# EasyEDA Pro project ProPrj_GSPro Keyboard_2026-01-17.epro, board PCB4
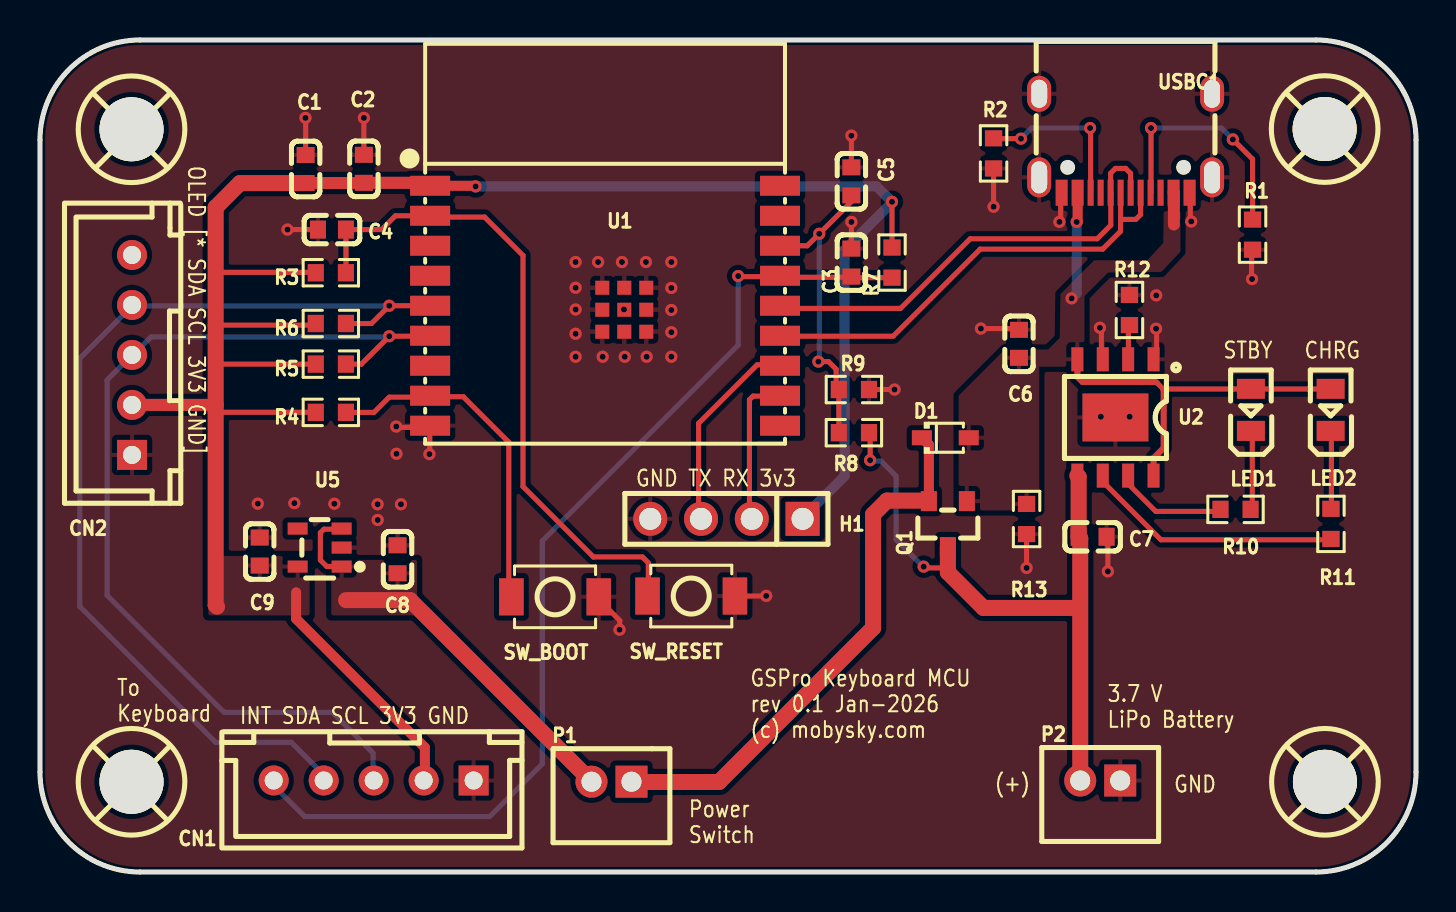
[diagram p5: board, top side]
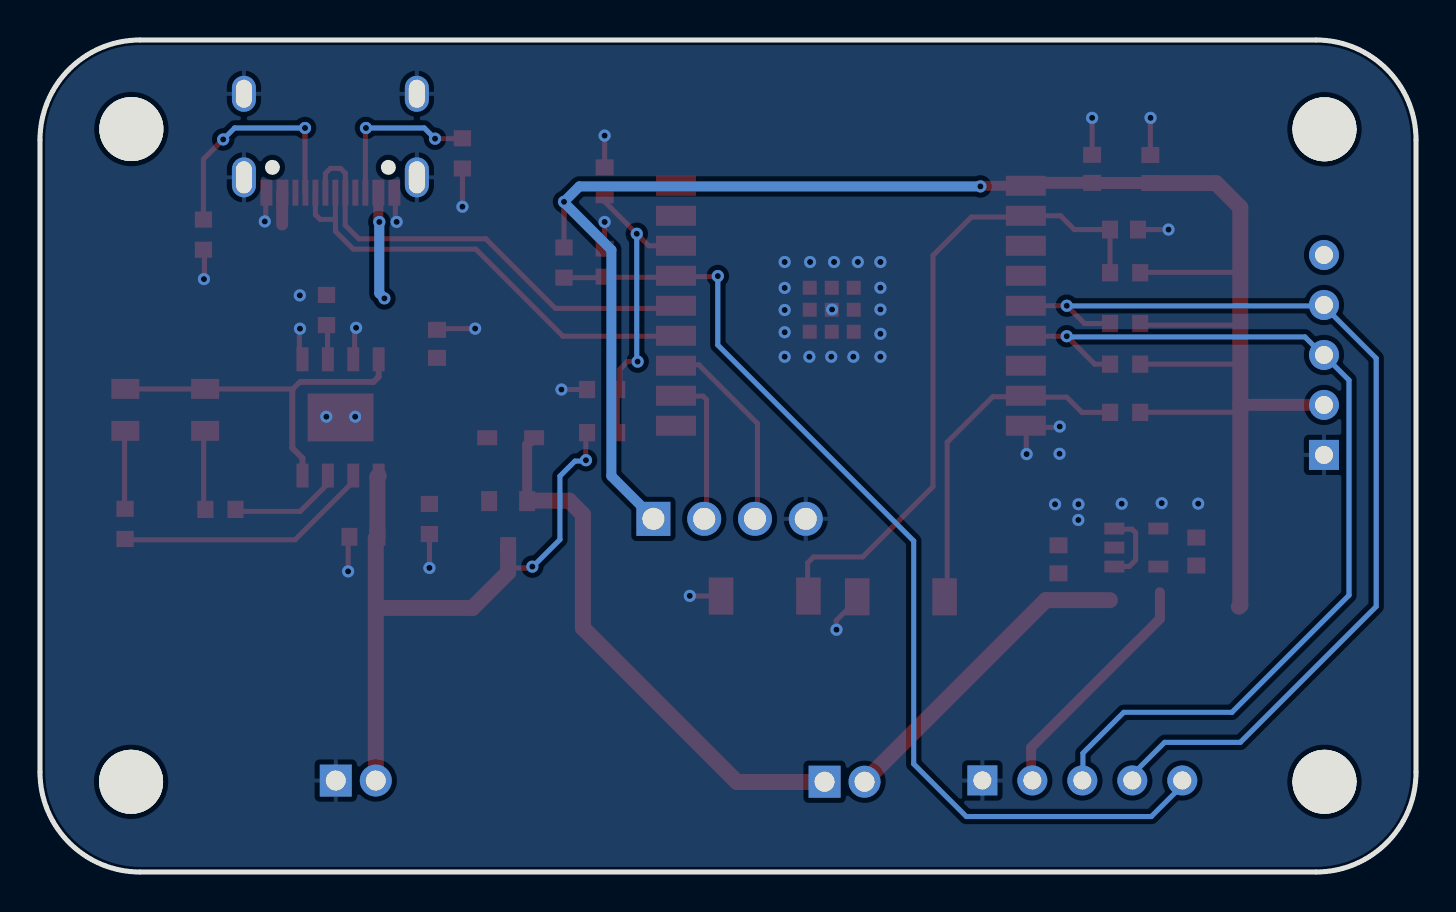
[diagram p6: board, bottom side, seen from below]

Outline 68.82 x 41.62 mm; copper layers: Top Layer, Bottom Layer. Coordinates in mm from the lower left corner of the outline.
Outline path: 0,36.62 0,5 arc(1.46,1.46) 5,0 63.82,0 arc(67.36,1.46) 68.82,5 68.82,36.62 arc(67.36,40.15) 63.82,41.62 5,41.62 arc(1.46,40.15) 0,36.62
Stack: Top Layer 0.035mm / Dielectric1 1.51mm FR4 er 4.5 / Bottom Layer 0.035mm

## Design rules (mm)
template: JLCPCB Capability(Two Layers Board)
spacing copperThickness1oz (default): track to track 0.102, other pairs 0.152 to 0.3
spacing copperThickness2oz: track to track 0.203, other pairs 0.152 to 0.3
track width copperThickness1oz (default): min 0.127, default 0.254, max 2.54
track width copperThickness2oz: min 0.203, default 0.254, max 2.54
differential pair differentialPair (default): width min 0.127, default 0.254, max 2.54; gap min 0.152, default 0.152
via viaSize (default): diameter min 0.5, default 0.61, max 10; hole min 0.3, default 0.305, max 6.3

## Placement (name value [footprint] x y rotation side)
C1  10uF  [C0603]  13.29 35.17 270 top
C2  100nF  [C0603]  16.2 35.17 270 top
C3  100nF  [C0603]  40.58 30.48 270 top
C4  1uF  [C0603]  14.6 32.14 0 top
C5  100nF  [C0603]  40.58 34.55 270 top
C6  10uF  [C0603]  48.97 26.42 270 top
C7  10uF  [C0603]  52.65 16.77 180 top
C8  10uF  [C0603]  17.88 15.64 270 top
C9  10uF  [C0603]  10.99 16.03 270 top
CN1  I2C_KEYBOARD  [CONN-TH_5P-P2.50_WAFER-XH254Z-5A]  16.69 4.58 180 top
CN2  I2C_OLED  [CONN-TH_5P-P2.50_WAFER-XH254Z-5A]  4.6 25.86 90 top
D1  1N5819WS  [SOD-323_L1.8-W1.3-LS2.5-RD]  45.28 21.72 0 top
H1  PZ254V-11-04P  [HDR-TH_4P-P2.54-V-M]  34.33 17.67 180 top
LED1  LED_R_CHRG  [LED0805-R-RD]  60.57 23.12 90 top
LED2  LED_G_FULL  [LED0805-R-RD]  64.55 23.12 90 top
P1  PWR_SWITCH  [CONN-TH_2P-P2.00_PH-2A_C2319]  28.58 4.52 0 top
P2  BAT  [CONN-TH_2P-P2.00_PH-2A_C2319]  53.03 4.58 0 top
Q1  AO3401A  [SOT-23_L2.9-W1.3-P1.90-LS2.4-BR]  45.41 17.4 90 top
R1  5.1kΩ  [R0603]  60.65 31.88 90 top
R2  5.1kΩ  [R0603]  47.69 35.95 90 top
R3  10kΩ  [R0603]  14.55 29.98 180 top
R4  10kΩ  [R0603]  14.55 22.99 180 top
R5  4.7kΩ  [R0603]  14.55 25.4 180 top
R6  4.7kΩ  [R0603]  14.55 27.44 180 top
R7  10kΩ  [R0603]  42.62 30.48 90 top
R8  100kΩ  [R0603]  40.71 21.98 0 top
R9  100kΩ  [R0603]  40.71 24.13 180 top
R10  1kΩ  [R0603]  59.8 18.14 0 top
R11  1kΩ  [R0603]  64.57 17.41 270 top
R12  2kΩ  [R0603]  54.49 28.11 90 top
R13  100kΩ  [R0603]  49.35 17.66 90 top
SCREW1  -  [Screw-Hole-M3]  4.64 37.09 0 top
SCREW2  -  [Screw-Hole-M3]  64.32 37.1 0 top
SCREW3  -  [Screw-Hole-M3]  64.33 4.45 0 top
SCREW4  -  [Screw-Hole-M3]  4.64 4.45 0 top
SW_BOOT  TS-1088-AR02016  [SW-SMD_L3.9-W3.0-P4.45]  25.76 13.77 0 top
SW_RESET  TS-1088-AR02016  [SW-SMD_L3.9-W3.0-P4.45]  32.57 13.8 0 top
U1  2.4GHz  [BULETM-SMD_ESPRESSIF_ESP32-C3-WROOM-02-N4-4MB]  28.26 28.33 0 top
U2  TP4056  [ESOP-8_L4.9-W3.9-P1.27-LS6.0-BL-EP]  53.79 22.74 180 top
U5  AP2112K-3.3TRG1  [SOT-23-5_L2.9-W1.6-P0.95-LS2.8-BR]  13.99 16.23 0 top
USBC1  TYPE-C-31-M-12  [USB-C_SMD-TYPE-C-31-M-12_1]  54.3 36.45 180 top

## Footprints (pads in the part's own frame, mm; a bottom-side part is the same pattern mirrored in y, then rotated)
BULETM-SMD_ESPRESSIF_ESP32-C3-WROOM-02-N4-4MB
  rect 2x1 smd: 1(-8.75,6) 2(-8.75,4.5) 3(-8.75,3) 4(-8.75,1.5) 5(-8.75,0) 6(-8.75,-1.5) 7(-8.75,-3) 8(-8.75,-4.5) 9(-8.75,-6) 10(8.75,-6) 11(8.75,-4.5) 12(8.75,-3) 13(8.75,-1.5) 14(8.75,0) 15(8.75,1.5) 16(8.75,3) 17(8.75,4.5) 18(8.75,6)
  rect 0.7x0.7 smd: 19(-0.14,0.9) 19(-0.14,-0.2) 19(-0.14,-1.3) 19(0.96,0.9) 19(0.96,-0.2) 19(0.96,-1.3) 19(2.06,0.9) 19(2.06,-0.2) 19(2.06,-1.3)
C0603
  rect 0.8x0.9 smd: 1(-0.7,0) 2(0.7,0)
CONN-TH_2P-P2.00_PH-2A_C2319
  rect 1.6x1.6 hole 1: 1(1,0)
  round 1.6 hole 1: 2(-1,0)
CONN-TH_5P-P2.50_WAFER-XH254Z-5A
  rect 1.5x1.5 hole 0.9: 1(-5,0)
  round 1.5 hole 0.9: 2(-2.5,0) 3(0,0) 4(2.5,0) 5(5,0)
ESOP-8_L4.9-W3.9-P1.27-LS6.0-BL-EP
  rect 0.6x1.2 smd: 1(-1.905,-2.909) 2(-0.635,-2.909) 3(0.635,-2.909) 4(1.905,-2.909) 5(1.905,2.909) 6(0.635,2.909) 7(-0.635,2.909) 8(-1.905,2.909)
  rect 3.3x2.4 smd: 9(0,0)
HDR-TH_4P-P2.54-V-M
  rect 1.7x1.7 hole 1.1: 1(-3.81,0)
  round 1.7 hole 1.1: 2(-1.27,0) 3(1.27,0) 4(3.81,0)
LED0805-R-RD
  rect 1x1.399 smd: 1(1.05,0) 2(-1.05,0)
R0603
  rect 0.806x0.864 smd: 1(-0.753,0) 2(0.753,0)
Screw-Hole-M3
  round 3.2 hole 3.2: 1(-0.064,0.064)
SOD-323_L1.8-W1.3-LS2.5-RD
  rect 1x0.75 smd: 1(-1.173,0) 2(1.173,0)
SOT-23-5_L2.9-W1.6-P0.95-LS2.8-BR
  rect 1x0.6 smd: 1(1.1,-0.95) 2(1.1,0) 3(1.1,0.95) 4(-1.1,0.95) 5(-1.1,-0.95)
SOT-23_L2.9-W1.3-P1.90-LS2.4-BR
  rect 1x0.8 smd: 1(1.15,-0.95) 2(1.15,0.95) 3(-1.15,0)
SW-SMD_L3.9-W3.0-P4.45
  rect 1.23x1.86 smd: 1(-2.185,0) 2(2.185,0)
USB-C_SMD-TYPE-C-31-M-12_1
  oval 1.2x2 hole 0.8x1.6: 1(4.325,1.706) 4(-4.325,1.706)
  oval 1.2x1.8 hole 0.8x1.4: 2(4.325,-2.474) 3(-4.325,-2.474)
  custom 0.6x1.3 smd: A1B12(-3.2,2.474) A4B9(-2.4,2.474) B1A12(3.2,2.474) B4A9(2.401,2.474)
  rect 0.3x1.3 smd: A5(-1.25,2.474) A6(-0.25,2.474) A7(0.25,2.474) A8(1.25,2.474) B5(1.75,2.474) B6(0.75,2.474) B7(-0.75,2.474) B8(-1.75,2.474)

## Nets
As in the schematic.

Pads without a net: CN2 5; SCREW1 1; SCREW2 1; SCREW3 1; SCREW4 1; U1 3 4 7 10 17 18; U5 4; USBC1 A8 B8

## Via types
v1: diameter 0.61, hole 0.305, Top Layer to Bottom Layer, 61 vias

## Routing (per net, layer and track width the routed paths; a pad name or vN(x,y) marks a point on that pad's centre or on a via; arc(x,y) is an arc through that point)
3V3: length 110.6
  Top Layer w0.254: R7.2 v1(42.62,33.52) ; 13.7,30 8.95,30 8.92,29.97 ; 8.79,23.01 8.8,23 13.79,23 ; 13.79,27.41 13.73,27.35 8.79,27.35 ; 13.74,25.4 8.81,25.4 ; 13.79,23 R4.2
  Top Layer w0.5: v1(21.79,34.29) 21.76,34.33 U1.1 ; 19.25,4.66 19.25,6.22 12.81,12.66 12.81,13.99
  Top Layer w0.6: U1.1 19.37,34.47 C2.2 16.19,34.47 C1.2 ; 4.47,23.37 8.79,23.37
  Top Layer w0.8: 8.86,13.27 8.79,13.34 8.79,33.24 10.01,34.46 13.15,34.46
  Bottom Layer w0.5: v1(42.62,33.52) 41.84,34.29 v1(21.79,34.29) ; 38.13,17.69 40.25,19.81 40.25,31.12 42.62,33.5
GND: length 27.9
  Top Layer w0.254: 53.09,25.94 53.09,26.98 52.97,27.1 ; 19.5,22.25 19.5,21 19.57,20.92 ; v1(49.35,15.21) R13.1 ; 30.33,29.21 30.36,29.18 ; v1(16.2,37.72) C2.1 ; R9.1 v1(42.74,24.13) ; 55.85,26.98 55.85,25.91 55.84,25.9 ; v1(47.69,33.28) R2.1 ; 53.37,16.67 53.41,16.63 v1(53.41,15.04) ; v1(47.06,27.18) 48.9,27.18 C6.1 ; 57.53,33.62 57.53,32.59 v1(57.58,32.54) ; 19.07,22.32 18.99,22.24 17.81,22.24 ; v1(50.99,32.52) 51.05,32.58 51.05,33.57 ; 29,12.21 29,12.58 28.32,13.26 ; 60.6,29.68 60.6,30.89 60.65,30.95 ; v1(40.58,32.52) C3.1 ; 34.84,13.95 34.99,13.8 36.31,13.8 v1(36.32,13.81) ; C1.1 13.29,37.71 v1(13.28,37.72) ; v1(12.38,32.14) C4.1 ; C5.1 v1(40.58,36.83)
  vias: v1(10.89,18.42) v1(12.72,18.45) v1(14.72,18.42) v1(16.89,18.4) v1(16.89,17.61) v1(17.82,22.28) v1(17.83,20.92) v1(18.05,18.4) v1(19.48,20.9) v1(26.79,30.51) v1(26.79,29.23) v1(26.79,28.14) v1(26.79,26.92) v1(26.79,25.77) v1(27.92,30.51) v1(28.14,25.77) v1(28.99,12.12) v1(29.11,30.51) v1(29.21,28.14) v1(29.25,25.77) v1(30.31,30.51) v1(30.34,25.77) v1(31.58,30.51) v1(31.58,29.22) v1(31.58,28.11) v1(31.58,27) v1(31.58,25.77) v1(53.01,27.22) v1(53.06,22.77) v1(54.5,22.77) v1(55.83,28.84) v1(55.82,27.18) v1(60.62,29.66)
VBAT: length 32.8
  Top Layer w0.254: 44.3,15.21 45.41,15.21 ; 41.51,21.88 41.52,21.87 41.52,20.59
  Top Layer w0.8: P2.2 52.03,16.69 C7.2 51.95,19.77 U2.5 ; Q1.3 45.41,14.99 47.19,13.21 51.76,13.21 51.76,13.21
  Bottom Layer w0.254: 41.51,20.56 42.06,20.56 42.82,19.8 42.82,16.63 44.18,15.26
  vias: v1(41.52,20.6) v1(44.2,15.28)
VBUS: length 25.6
  Top Layer w0.254: 55.88,24.46 55.82,24.52 55.78,24.52 55.88,24.46 ; 55.88,24.46 56.18,24.16 64.54,24.16 64.65,24.27
  Top Layer w0.3: U2.8 55.7,20.7 56.2,21.21 56.2,24.13 56.18,24.16 ; U2.4 51.89,24.77 52.14,24.52 55.78,24.52
  Top Layer w0.5: USBC1.B4A9 51.9,32.56 v1(51.85,32.52)
  Top Layer w0.6: 56.71,32.39 56.71,33.97 USBC1.A4B9
  Bottom Layer w0.5: v1(51.6,28.69) 51.85,28.95 v1(51.85,32.52)
BAT_SENSE: length 15.5
  Top Layer w0.254: v1(38.93,25.53) 39.44,25.53 39.82,25.15 39.82,24.27 R9.2 R8.1 ; U1.16 38.38,31.33 v1(38.97,31.92) 40.58,33.53 C5.2
  Bottom Layer w0.254: v1(38.93,25.53) 38.97,25.57 v1(38.97,31.92)
BOOT: length 16.7
  Top Layer w0.254: 23.45,14.05 23.45,21.5 21.17,23.77 19.78,23.77 19.72,23.83 ; R4.1 16.71,22.99 17.47,23.75 19.44,23.75 U1.8
D+: length 23.1
  Top Layer w0.254: U1.14 37.15,28.19 43.04,28.19 46.52,31.67 52.88,31.67 53.56,32.35 53.56,33.97 USBC1.B6 53.55,34.95 53.79,35.2 54.3,35.2 54.55,34.95 USBC1.A6
D-: length 23.3
  Top Layer w0.254: U1.13 37.04,26.8 42.67,26.8 47.03,31.16 53.15,31.16 54.05,32.05 54.05,32.51 54.05,32.52 54.05,32.64 ; USBC1.A7 54.05,32.64 ; 54.05,32.64 54.81,32.64 55.05,32.89 USBC1.B7
EN: length 33
  Top Layer w0.254: 30.43,13.69 30.43,15.46 30.13,15.76 27.68,15.76 24.16,19.28 24.16,30.84 22.24,32.76 19.87,32.76 19.81,32.7 ; R3.1 15.3,29.98 C4.2 17.09,32.14 17.78,32.83 U1.2
MCU_KBINT: length 50.8
  Top Layer w0.254: R7.1 40.64,29.73 ; 40.46,29.67 40.38,29.75 37.41,29.75 ; 34.93,29.78 36.96,29.78 37.01,29.83
  Bottom Layer w0.254: 35,29.83 34.92,29.75 34.92,26.36 25.12,16.56 25.12,5.41 22.49,2.78 13.24,2.78 11.7,4.31
  vias: v1(34.92,29.81)
MCU_SCL: length 48.2
  Top Layer w0.254: R5.1 16.07,25.4 v1(17.47,26.8) 19.49,26.8 U1.6
  Bottom Layer w0.254: 4.48,25.73 3.35,24.6 3.35,13.84 9.21,7.99 14.62,7.99 16.66,5.95 16.66,4.68 ; 17.47,26.77 5.56,26.77 4.62,25.83
MCU_SDA: length 49.3
  Top Layer w0.254: U1.5 v1(17.47,28.33) 16.58,27.44 R6.1
  Bottom Layer w0.254: 17.49,28.29 17.46,28.32 4.57,28.32 ; 4.54,28.24 1.99,25.7 1.99,13.28 8.79,6.48 12.57,6.48 14.1,4.96 14.1,4.71
RX: length 7.4
  Top Layer w0.254: 36.72,23.71 36.64,23.8 35.66,23.8 35.48,23.62 35.48,17.59
TX: length 9.3
  Top Layer w0.254: 32.94,17.83 32.94,22.44 35.87,25.37 36.46,25.37
$1N1258: length 8.3
  Top Layer w0.254: v1(52.52,37.22) 52.55,37.19 USBC1.B5 ; v1(49.06,36.68) 47.71,36.68 R2.2
  Bottom Layer w0.254: v1(52.52,37.22) 49.6,37.22 v1(49.06,36.68)
$1N1320: length 12
  Top Layer w0.254: R1.2 60.65,35.66 v1(59.66,36.64) ; v1(55.57,37.22) 55.57,34 USBC1.A5
  Bottom Layer w0.254: v1(55.57,37.22) 59.09,37.22 v1(59.66,36.64)
$2N289: length 1.6
  Top Layer w0.254: 54.44,27.22 54.44,25.65
$2N510: length 3.8
  Top Layer w0.254: 60.64,18.19 60.64,21.92 60.56,22
$2N517: length 5.4
  Top Layer w0.254: 54.43,19.42 55.81,18.04 58.82,18.04 59.1,18.31
$2N523: length 3.8
  Top Layer w0.254: 64.5,22.02 64.59,21.93 64.59,18.21
$2N529: length 12.1
  Top Layer w0.254: 53.29,19.4 56.06,16.62 64.27,16.62
$2N2193: length 27.3
  Top Layer w0.5: Q1.2 44.46,21.37 D1.1
  Top Layer w0.8: 29.59,4.5 33.96,4.5 41.67,12.21 41.67,17.89 42.36,18.58 44.39,18.58
$2N5947: length 19.3
  Top Layer w0.254: 14.7,17.17 14.68,17.15 14.2,17.15 14.02,16.97 14.02,15.6 14.34,15.29 15.05,15.29
  Top Layer w0.8: 15.31,13.6 18.51,13.6 27.58,4.53

## Copper pours and planes (outline as drawn; the poured copper is in the pictures)
3V3 on Top Layer: 8.42,15.81 13.48,15.81 13.48,12.84 8.42,12.84
GND on Top Layer: 11.42,19.11 16.24,19.11 16.24,17.77 11.42,17.77
GND on Top Layer: 15.89,19.11 18.87,19.11 18.87,15.87 15.89,15.87
GND on Top Layer: 10.08,19.11 11.91,19.11 11.91,16.31 10.08,16.31
GND on Top Layer: -0.98,42.44 69.63,42.44 69.63,-1.03 -0.98,-1.03
GND on Top Layer: 26.2,31.09 32.2,31.09 32.2,25.16 26.2,25.16
GND on Top Layer: 14.55,16.6 16.28,16.6 16.28,15.87 14.55,15.87
GND on Bottom Layer: -0.98,42.59 69.63,42.59 69.63,-0.8 -0.98,-0.8
VBUS on Top Layer: 52.24,25.28 48.58,25.28 48.46,25.4 48.46,26.14 50.42,26.14 51.01,26.72 51.04,28.91 52.73,30.6 55.39,30.6 56.18,31.47 56.2,33.05 57.04,33.06 57.04,31.03 56.09,30.02 53.42,29.99 52.24,28.81
VBUS on Top Layer: 49.98,18.08 45.94,18.08 45.94,23.83 48.25,26.14 49.88,26.14 49.98,26.04
$2N5947 on Top Layer: 14.57,15.62 18.86,15.62 18.86,12.84 14.57,12.84

## Text on the board
Top Silkscreen Layer: To / Keyboard | INT SDA SCL 3V3 GND | GND TX RX 3v3 | Power / Switch | GSPro Keyboard MCU / rev 0.1 Jan-2026 / (c) mobysky.com | (+) | 3.7 V / LiPo Battery | GND | STBY | CHRG | OLED [* SDA SCL 3V3 GND]
